# Altium schematic sheet Sheet1.SchDoc
size A
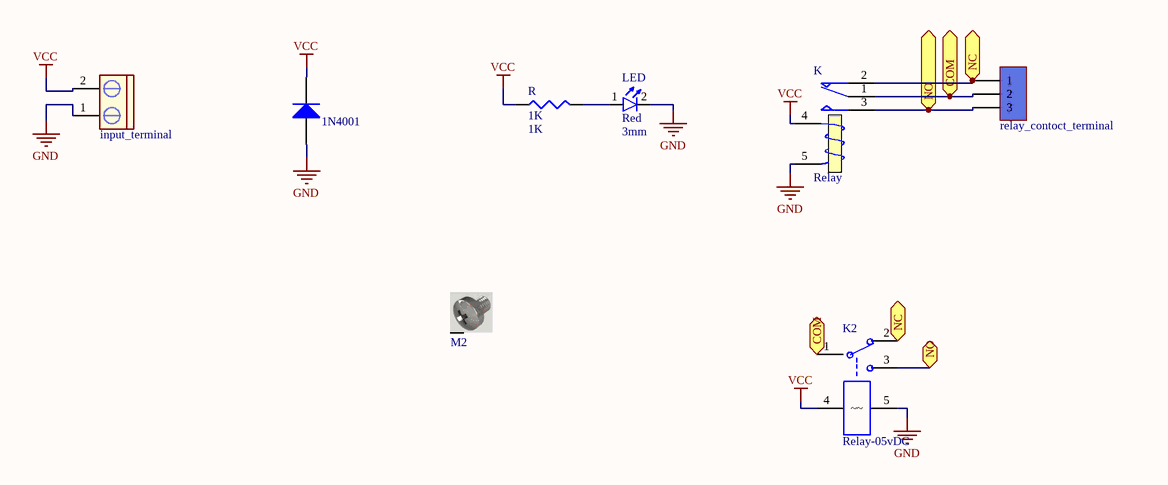
[diagram p0: Sheet1.SchDoc]

## Parts
1N4001  Diode 1N4007 vertical  [D 50mm]  (value not drawn)
input_terminal  CON2 pin blue  [My_CN2]  (value not drawn)
K  Relay  [Relay 15.40x12.10x13.10]
K2  Relay-05vDC  [Relays]
LED  Size: 3mm  [LED-3mm]  (hidden comment: Red)
M2  Screw  [Board Screw_No Silk]  (value not drawn)
R  1K  [AXIAL0.4]
relay_contoct_terminal  Terminal  [Terminal 1*3]  (value not drawn)

## Ports
COM, NC, NO

## Nets
GND: 1N4001.1(A) input_terminal.1 K.5(T2) K2.5 LED.2(K)
VCC: 1N4001.2(K) input_terminal.2 K.4(T1) K2.4 R.1
COM: K.1(COM) K2.1(COM) relay_contoct_terminal.2 ; port COM
NC: K.2(NC) K2.2(NC) relay_contoct_terminal.1 ; port NC
NO: K.3(NO) K2.3(NO) relay_contoct_terminal.3 ; port NO
NetLED_1: LED.1(A) R.2

Not connected (* = marked no-connect by the designer): M2 S

## Library data of the parts
1N4001 = Diode 1N4007 vertical: 1 Amp General Purpose Rectifier; Publisher: seyed mohsen ghasemian
input_terminal = CON2 pin blue: Connector blue screw
K = Relay: SPDT Relay; Designer: Eng. Saeid Jorablo; Company: E.P.I.L; Design_Date: 2011/10/31
K2 = Relay-05vDC: Relay-05vDC-240AC 5A; Designer: Seyed Mohsen Ghasemain; ComponentLinkURL: www.picpars.com
LED = LED: Designer: Saeid Jorablo; Organazation: ControTec; Adding Date: 1387/12/22; Color: Red
M2 = Board Screw: Board Screw With Spacer
R = Res3: Resistor; Published: 8-Jun-2000; LatestRevisionDate: 29-May-2009; LatestRevisionNote: IPC-7351 Footprint Added.; PackageReference: J1-0603; Publisher: Altium Limited; PackageDescription: Chip Resistor; Value: 1K
relay_contoct_terminal = Terminal 1*3: Terminal 3 Pin 250VAC 16A; Designer: Seyed Mohsen Ghasemain; E-mail: picpars@gmail.com; ComponentLinkURL: www.picpars.com